# Altium schematic sheet LCDTFT_FPCADPTR40T50P.SchDoc: =DocumentName
size A3; DocumentNumber: 11; SheetNumber: 1; SheetTotal: 1
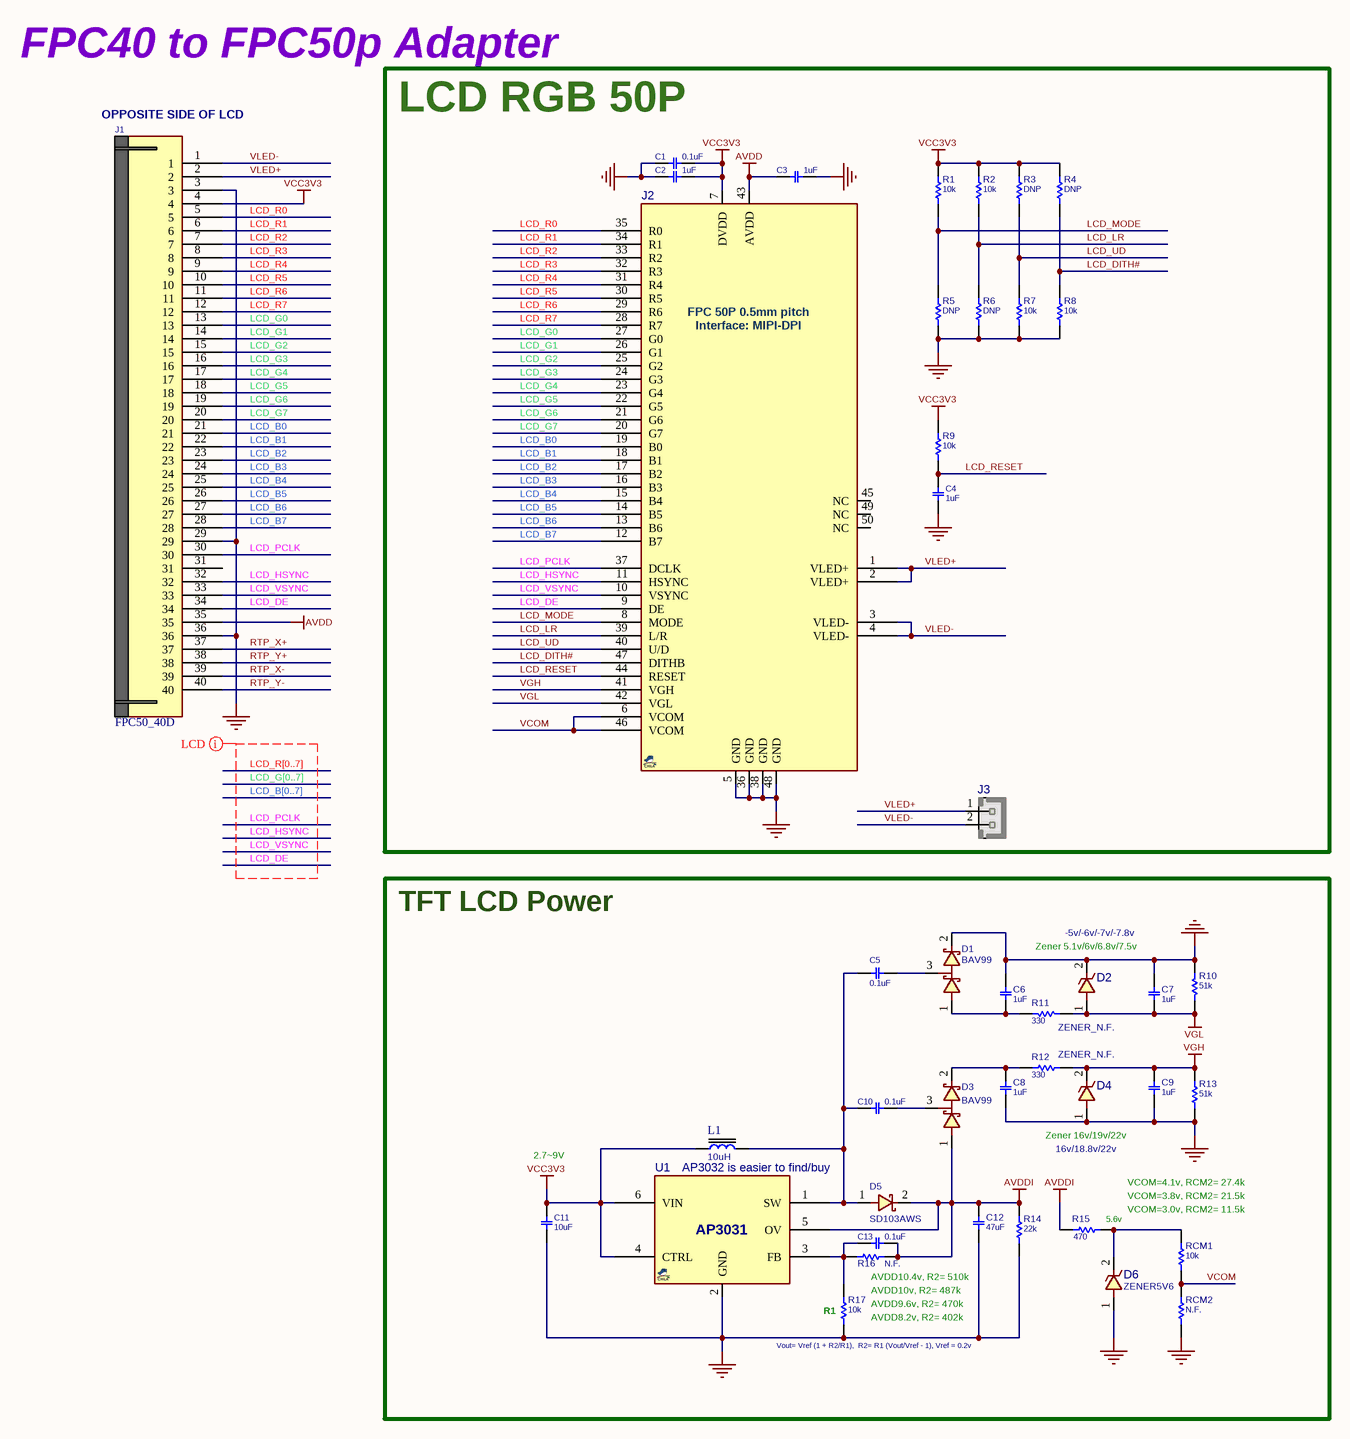
[diagram p0: LCDTFT_FPCADPTR40T50P.SchDoc]

## Parts
C1  0.1uF  [C0402]
C2  1uF  [C0402]
C3  1uF  [C0402]
C4  1uF  [C0402]
C5  0.1uF  [C0402]
C6  1uF  [C0603]
C7  1uF  [C0603]
C8  1uF  [C0603]
C9  1uF  [C0603]
C10  0.1uF  [C0402]
C11  10uF  [C0603]
C12  47uF  [C1206]
C13  0.1uF  [C0402]
D1  BAV99  [SOT23_3]
D2  ZENER_N.F.  [D_SOD123W]
D3  BAV99  [SOT23_3]
D4  ZENER_N.F.  [D_SOD123W]
D5  SD103AWS  [D_SOD323]
D6  ZENER5V6  [D_SOD123W]
J1  FPC50_40D  [FPC50_40D_FFC2B29]
J2  FPC_50_0.5mm  [FPC50_50T]  (value not drawn)
J3  HHDR_2  [ER_CON3P5_2_SMD]  (value not drawn)
L1  10uH  [L_4]
R1  10k  [R0402]
R2  10k  [R0402]
R3  DNP  [R0402]
R4  DNP  [R0402]
R5  DNP  [R0402]
R6  DNP  [R0402]
R7  10k  [R0402]
R8  10k  [R0402]
R9  10k  [R0402]
R10  51k  [R0402]
R11  330  [R0402]
R12  330  [R0402]
R13  51k  [R0402]
R14  22k  [R0402]
R15  470  [R0402]
R16  N.F.  [R0402]
R17  10k  [R0402]
RCM1  10k  [R0402]
RCM2  N.F.  [R0402]
U1  AP3031  [SOT23_6]  (value not drawn)

## Blocks framed on the sheet
LCD RGB 50P: C1-C4 J2 J3 R1-R9
TFT LCD Power: C5-C13 D1-D6 L1 R10-R17 RCM1 RCM2 U1

## Nets
AVDD: C3.2 J1.35 J2.43(AVDD)
AVDDI: C12.2 C13.1 D3.1 D5.2 R14.1 R15.1 R16.2 U1.5(OV)
GND: C1.2 C2.2 C3.1 C4.2 C6.1 C7.1 C8.1 C9.1 C11.1 C12.1 D1.2 D2.2 D4.1 D6.1 J1.3 J1.29 J1.36 J2.5(GND) J2.36(GND) J2.38(GND) J2.48(GND) R5.2 R6.2 R7.2 R8.2 R10.1 R13.1 R14.2 R17.2 RCM2.2 U1.2(GND)
VCC3V3: C1.1 C2.1 C11.2 J1.4 J2.7(DVDD) L1.1 R1.1 R2.1 R3.1 R4.1 R9.1 U1.4(CTRL) U1.6(VIN)
VGH: C9.2 D4.2 J2.41(VGH) R12.2 R13.2
VGL: C7.2 D2.1 J2.42(VGL) R10.2 R11.2
LCD_B0: J1.21 J2.19(B0)
LCD_B1: J1.22 J2.18(B1)
LCD_B2: J1.23 J2.17(B2)
LCD_B3: J1.24 J2.16(B3)
LCD_B4: J1.25 J2.15(B4)
LCD_B5: J1.26 J2.14(B5)
LCD_B6: J1.27 J2.13(B6)
LCD_B7: J1.28 J2.12(B7)
LCD_DE: J1.34 J2.9(DE)
LCD_DITH#: J2.47(DITHB) R4.2 R8.1
LCD_G0: J1.13 J2.27(G0)
LCD_G1: J1.14 J2.26(G1)
LCD_G2: J1.15 J2.25(G2)
LCD_G3: J1.16 J2.24(G3)
LCD_G4: J1.17 J2.23(G4)
LCD_G5: J1.18 J2.22(G5)
LCD_G6: J1.19 J2.21(G6)
LCD_G7: J1.20 J2.20(G7)
LCD_HSYNC: J1.32 J2.11(HSYNC)
LCD_LR: J2.39(L/R) R2.2 R6.1
LCD_MODE: J2.8(MODE) R1.2 R5.1
LCD_PCLK: J1.30 J2.37(DCLK)
LCD_R0: J1.5 J2.35(R0)
LCD_R1: J1.6 J2.34(R1)
LCD_R2: J1.7 J2.33(R2)
LCD_R3: J1.8 J2.32(R3)
LCD_R4: J1.9 J2.31(R4)
LCD_R5: J1.10 J2.30(R5)
LCD_R6: J1.11 J2.29(R6)
LCD_R7: J1.12 J2.28(R7)
LCD_RESET: C4.1 J2.44(RESET) R9.2
LCD_UD: J2.40(U/D) R3.2 R7.1
LCD_VSYNC: J1.33 J2.10(VSYNC)
RTP_X+: J1.37
RTP_X-: J1.39
RTP_Y+: J1.38
RTP_Y-: J1.40
VCOM: J2.6(VCOM) J2.46(VCOM) RCM1.2 RCM2.1
VLED+: J1.2 J2.1(VLED+) J2.2(VLED+) J3.1
VLED-: J1.1 J2.3(VLED-) J2.4(VLED-) J3.2
NetC5_1: C5.1 D1.3
NetC5_2: C5.2 C10.2 D5.1 L1.2 U1.1(SW)
NetC6_2: C6.2 D1.1 R11.1
NetC8_2: C8.2 D3.2 R12.1
NetC10_1: C10.1 D3.3
NetC13_2: C13.2 R16.1 R17.1 U1.3(FB)
NetD6_2: D6.2 R15.2 RCM1.1

Not connected (* = marked no-connect by the designer): J1 31; J2 45(NC) 49(NC) 50(NC)

## Buses and harness runs
bus LCD_B[0..7]
bus LCD_G[0..7]
bus LCD_R[0..7]

## Layout directives
net class LCD: LCD_B[0..7], LCD_DE, LCD_G[0..7], LCD_HSYNC, LCD_PCLK, LCD_R[0..7], LCD_VSYNC

## Notes on the sheet
- FPC40 to FPC50p Adapter
- (near J1) OPPOSITE SIDE OF LCD
- (near D2) Zener 5.1v/6v/6.8v/7.5v
- -5v/-6v/-7v/-7.8v
- 2.7~9V
- (near L1) AP3032 is easier to find/buy
- (near D4) Zener 16v/19v/22v
- (near D4) 16v/18.8v/22v
- (near R15) 5.6v
- VCOM=4.1v, RCM2= 27.4k
- VCOM=3.8v, RCM2= 21.5k
- VCOM=3.0v, RCM2= 11.5k
- (near R17) R1
- (near R16) AVDD10.4v, R2= 510k
- AVDD10v, R2= 487k
- AVDD9.6v, R2= 470k
- (near R17) Vout= Vref (1 + R2/R1),  R2= R1 (Vout/Vref - 1), Vref = 0.2v
- (near R17) AVDD8.2v, R2= 402k
- Title:
- Project:
- Sheet:
- Revision:
- of
- Engineer:
- Approved By:
- File:
- (in symbol LCDTFT_DPI_FPC50P) FPC 50P 0.5mm pitch; Interface: MIPI-DPI

## Library data of the parts
C1 = CAP_SMD_MLCC: CAP, MLCC; PARAM: X7R, 10%, -55~125oC; MANF_P#: GRM155R71H104KE14D; MANF: Murata; PARAM2: 50v; PRICE: 100: 0.018$; ASSEMBLY: ASSEMBLY; VALUE: 0.1uF
C2-C4 = CAP_SMD_MLCC: CAP, MLCC; PARAM: X5R, 10%; MANF_P#: CL05A105KO5NNND; MANF: Samsung; PARAM2: 16v; PRICE: 50,000:	$0.006; ASSEMBLY: ASSEMBLY; VALUE: 1uF
C5 C10 C13 = CAP_SMD_MLCC_100n50V: CAP, MLCC, 100nF, 50V, X7R, 10%, 0402C; MANF: Murata; MANF_P#: GCM155R71H104KE02D; PARAM: 50V; DESC: CAP, MLCC, 100nF, 50V, X7R, 10%, 0402C; PARAM2: X7R, 10%; ASSEMBLY: ASSEMBLY; PRICE: 100= 1.3$; VALUE: 0.1uF
C6-C9 = CAP_SMD_MLCC: CAP, MLCC; PARAM: X5R, 10%; MANF_P#: CL10A105KB8NNNC; MANF: Samsung; PARAM2: 50v; PRICE: 50,000:	$0.006; ASSEMBLY: ASSEMBLY; VALUE: 1uF
C11 = CAP_SMD_MLCC: CAP, MLCC; PARAM: X5R, 10%; MANF_P#: CL10A106MO8NQNC; MANF: Samsung; PARAM2: 16v; PRICE: 5000:	$0.01; ASSEMBLY: ASSEMBLY; VALUE: 10uF
C12 = CAP_SMD_MLCC: CAP, MLCC; PARAM: X5R, 10%; MANF_P#: GRM31CR61E476ME44L; MANF: Murata; PARAM2: 25v; PRICE: 100:	$0.27; ASSEMBLY: ASSEMBLY; VALUE: 47uF
D1 D3 = DIODE_SMD_SCHOTTKY_BAV99: DIODE, SCHOTTKY, DUAL, 30V, 0.2A; MANF: Diodes; DESC: DESCRIPTION; PARAM: 30V/200MW; MANF_P#: BAV99; ASSEMBLY: ASSEMBLY; PRICE: PRICE; PARAM2: 0.2A; VALUE: BAV99
D2 D4 D6 = DIODE_SMD_ZENER_DFLZ5V1: DIODE, ZENER, 0.5W; MANF: Diodes; DESC: DESCRIPTION; PARAM: 0.5W, -55~150oC; ASSEMBLY: ASSEMBLY; PRICE: 0.5$; PARAM2: -; MANF_P#: -
  D2 D4: VALUE: ZENER_N.F.
  D6: VALUE: ZENER5V6
D5 = DIODE_SMD_SCHOTTKY_1N5819: DIODE, SCHOTTKY, 40V, 2A; MANF: DIODES; DESC: DESCRIPTION; MANF_P#: SD103AWS; ASSEMBLY: ASSEMBLY; PRICE: PRICE; PARAM2: 2A; PARAM: 40V; VALUE: SD103AWS
J1 = FPC50_40D_FFC2B29: CONN, FPC, 0.50mm pitch, RightAngle, Dual side Contact; MANF: GCT; MANF_P#: FFC2B29-40-G; VALUE: FPC50_40D
J2 = LCDTFT_DPI_FPC50P: LCD TFT Color, FPC50P, RGB; MANF: -; MANF_P#: -; PARAM: -; VALUE: FPC_50_0.5mm
J3 = XH_2: JST-XH pitch: 2.5mm; VALUE: HHDR_2
L1 = INDPWR_SMD: INDUCTOR, POWER, SMD; MANF_P#: GCD43-100MC; VALUE: 10uH
R1-R9 = RES_SMD: RESISTOR, SMD; PARAM: 0.063W; DESC: DESCRIPTION; DIST#: MOUSER; PARAM2: 1%; MANF_P#: -; MANF: -; ASSEMBLY: ASSEMBLY; PRICE: 100= 0.3$
  R1 R2 R7-R9: VALUE: 10k
  R3-R6: VALUE: DNP
R10-R17 RCM1 RCM2 = RES_SMD: RESISTOR, SMD, 20K, 0402; MANF: Yageo; PARAM: 0.063W; DIST#: MOUSER; PARAM2: 1%; MANF_P#: RK73H1ETTP2002F; ASSEMBLY: ASSEMBLY; PRICE: 100= 0.5$; DESC: RESISTOR, SMD, 20K, 0402
  R10 R13: VALUE: 51k
  R11 R12: VALUE: 330
  R14: VALUE: 22k
  R15: VALUE: 470
  R16 RCM2: VALUE: N.F.
  R17 RCM1: VALUE: 10k
U1 = VREG_AP3031_SOT23: REG, Switching, Boost, 1.4A, ADJ, 1MHz, SOT-23-6; PARAM: 1.4A, 1MHz, -40~85oC; PARAM2: 2.7~16VIN; MANF_P#: AP3031K; MANF: Diodes; PRICE: 0.1$; VALUE: AP3031